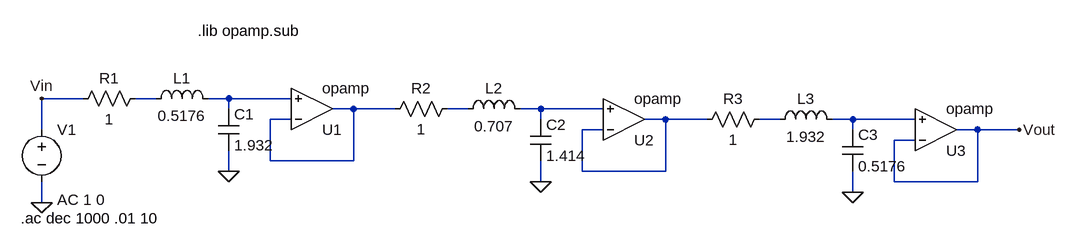
[diagram p0: schematic 26TS_2.asc]
26TS_2.asc, the LTspice schematic file:
Version 4.1
SHEET 1 1384 680
WIRE -128 80 -192 80
WIRE -16 80 -48 80
WIRE 96 80 64 80
WIRE 192 80 96 80
WIRE 96 96 96 80
WIRE 288 96 256 96
WIRE 352 96 288 96
WIRE 464 96 432 96
WIRE 576 96 544 96
WIRE 672 96 576 96
WIRE 192 112 160 112
WIRE 576 112 576 96
WIRE 768 112 736 112
WIRE 832 112 768 112
WIRE 944 112 912 112
WIRE 1056 112 1024 112
WIRE 1152 112 1056 112
WIRE -192 128 -192 80
WIRE 672 128 640 128
WIRE 1056 128 1056 112
WIRE 1248 128 1216 128
WIRE 1312 128 1248 128
WIRE 1152 144 1120 144
WIRE 160 176 160 112
WIRE 288 176 288 96
WIRE 288 176 160 176
WIRE 96 192 96 160
WIRE 640 192 640 128
WIRE 768 192 768 112
WIRE 768 192 640 192
WIRE 576 208 576 176
WIRE 1120 208 1120 144
WIRE 1248 208 1248 128
WIRE 1248 208 1120 208
WIRE 1056 224 1056 192
WIRE -192 240 -192 208
FLAG 96 192 0
FLAG -192 240 0
FLAG 576 208 0
FLAG 1056 224 0
FLAG 1312 128 Vout
FLAG -192 80 Vin
SYMBOL cap 80 96 R0
SYMATTR InstName C1
SYMATTR Value 1.932
SYMBOL res -32 64 R90
WINDOW 0 0 56 VBottom 2
WINDOW 3 32 56 VTop 2
SYMATTR InstName R1
SYMATTR Value 1
SYMBOL ind -32 96 R270
WINDOW 0 32 56 VTop 2
WINDOW 3 5 56 VBottom 2
SYMATTR InstName L1
SYMATTR Value 0.5176
SYMATTR SpiceLine Rser=1m
SYMBOL OpAmps\\opamp 224 160 M180
SYMATTR InstName U1
SYMBOL voltage -192 112 R0
WINDOW 123 24 124 Left 2
WINDOW 39 0 0 Left 0
SYMATTR InstName V1
SYMATTR Value ""
SYMATTR Value2 AC 1 0
SYMBOL cap 560 112 R0
SYMATTR InstName C2
SYMATTR Value 1.414
SYMBOL res 448 80 R90
WINDOW 0 0 56 VBottom 2
WINDOW 3 32 56 VTop 2
SYMATTR InstName R2
SYMATTR Value 1
SYMBOL ind 448 112 R270
WINDOW 0 32 56 VTop 2
WINDOW 3 5 56 VBottom 2
SYMATTR InstName L2
SYMATTR Value 0.707
SYMATTR SpiceLine Rser=1m
SYMBOL OpAmps\\opamp 704 176 M180
SYMATTR InstName U2
SYMBOL cap 1040 128 R0
SYMATTR InstName C3
SYMATTR Value 0.5176
SYMBOL res 928 96 R90
WINDOW 0 0 56 VBottom 2
WINDOW 3 32 56 VTop 2
SYMATTR InstName R3
SYMATTR Value 1
SYMBOL ind 928 128 R270
WINDOW 0 32 56 VTop 2
WINDOW 3 5 56 VBottom 2
SYMATTR InstName L3
SYMATTR Value 1.932
SYMATTR SpiceLine Rser=1m
SYMBOL OpAmps\\opamp 1184 192 M180
SYMATTR InstName U3
TEXT -224 264 Left 2 !.ac dec 1000 .01 10
TEXT 48 -24 Left 2 !.lib opamp.sub

The netlist it stands for:
* 26TS_2.asc
C1 N002 0 1.932
R1 N001 Vin 1
L1 N001 N002 0.5176 Rser=1m
X§U1 N003 N002 N003 opamp Aol=100K GBW=10Meg  ; pins invin noninvin out
V1 Vin 0 AC 1 0
C2 N005 0 1.414
R2 N004 N003 1
L2 N004 N005 0.707 Rser=1m
X§U2 N006 N005 N006 opamp Aol=100K GBW=10Meg  ; pins invin noninvin out
C3 N008 0 0.5176
R3 N007 N006 1
L3 N007 N008 1.932 Rser=1m
X§U3 Vout N008 Vout opamp Aol=100K GBW=10Meg  ; pins invin noninvin out
.ac dec 1000 .01 10
.lib opamp.sub
.backanno
.end